# Altium project 转叶板.PrjPcb
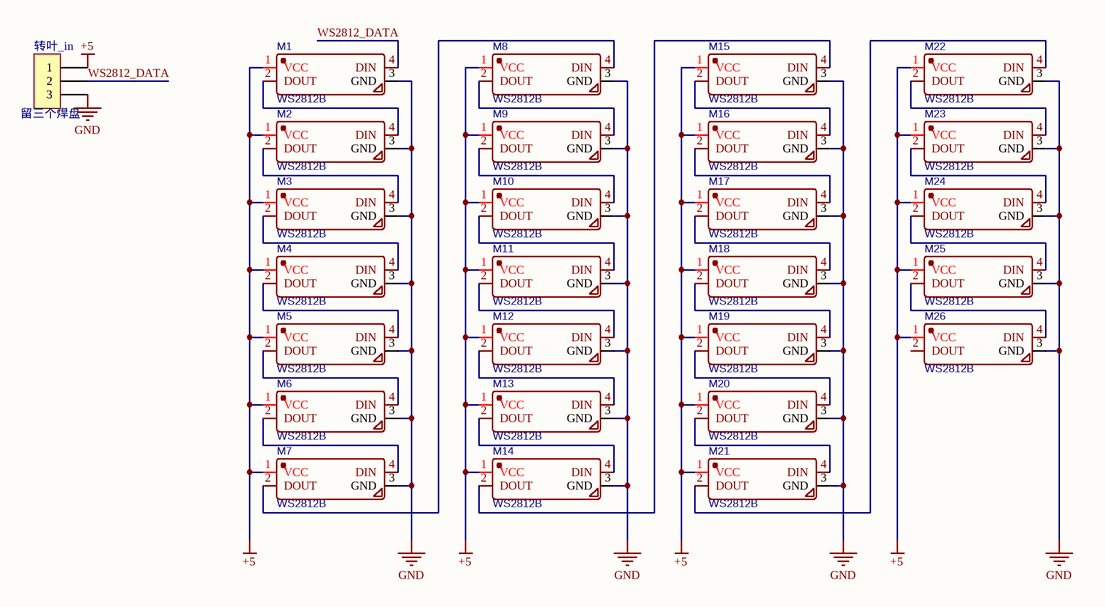
[diagram p0: 转叶板-转叶.SchDoc]
1 sheet, 27 parts. Net scope: global (net labels, ports and power ports of the same name join across sheets).
Board file: 转叶板-转叶.PcbDoc

## Sheet 转叶板-转叶.SchDoc
size A4; SheetNumber: 1; SheetTotal: 1

### Parts
M1  WS2812B  [WS2812-NEW]
M2  WS2812B  [WS2812-NEW]
M3  WS2812B  [WS2812-NEW]
M4  WS2812B  [WS2812-NEW]
M5  WS2812B  [WS2812-NEW]
M6  WS2812B  [WS2812-NEW]
M7  WS2812B  [WS2812-NEW]
M8  WS2812B  [WS2812-NEW]
M9  WS2812B  [WS2812-NEW]
M10  WS2812B  [WS2812-NEW]
M11  WS2812B  [WS2812-NEW]
M12  WS2812B  [WS2812-NEW]
M13  WS2812B  [WS2812-NEW]
M14  WS2812B  [WS2812-NEW]
M15  WS2812B  [WS2812-NEW]
M16  WS2812B  [WS2812-NEW]
M17  WS2812B  [WS2812-NEW]
M18  WS2812B  [WS2812-NEW]
M19  WS2812B  [WS2812-NEW]
M20  WS2812B  [WS2812-NEW]
M21  WS2812B  [WS2812-NEW]
M22  WS2812B  [WS2812-NEW]
M23  WS2812B  [WS2812-NEW]
M24  WS2812B  [WS2812-NEW]
M25  WS2812B  [WS2812-NEW]
M26  WS2812B  [WS2812-NEW]
转叶_in  留三个焊盘  [Pin HDR1X3/2.54mm-S]

### Nets
+5: M1.1(VCC) M2.1(VCC) M3.1(VCC) M4.1(VCC) M5.1(VCC) M6.1(VCC) M7.1(VCC) M8.1(VCC) M9.1(VCC) M10.1(VCC) M11.1(VCC) M12.1(VCC) M13.1(VCC) M14.1(VCC) M15.1(VCC) M16.1(VCC) M17.1(VCC) M18.1(VCC) M19.1(VCC) M20.1(VCC) M21.1(VCC) M22.1(VCC) M23.1(VCC) M24.1(VCC) M25.1(VCC) M26.1(VCC) 转叶_in.1
GND: M1.3(GND) M2.3(GND) M3.3(GND) M4.3(GND) M5.3(GND) M6.3(GND) M7.3(GND) M8.3(GND) M9.3(GND) M10.3(GND) M11.3(GND) M12.3(GND) M13.3(GND) M14.3(GND) M15.3(GND) M16.3(GND) M17.3(GND) M18.3(GND) M19.3(GND) M20.3(GND) M21.3(GND) M22.3(GND) M23.3(GND) M24.3(GND) M25.3(GND) M26.3(GND) 转叶_in.3
WS2812_DATA: M1.4(DIN) 转叶_in.2
NetM1_2: M1.2(DOUT) M2.4(DIN)
NetM2_2: M2.2(DOUT) M3.4(DIN)
NetM3_2: M3.2(DOUT) M4.4(DIN)
NetM4_2: M4.2(DOUT) M5.4(DIN)
NetM5_2: M5.2(DOUT) M6.4(DIN)
NetM6_2: M6.2(DOUT) M7.4(DIN)
NetM7_2: M7.2(DOUT) M8.4(DIN)
NetM8_2: M8.2(DOUT) M9.4(DIN)
NetM9_2: M9.2(DOUT) M10.4(DIN)
NetM10_2: M10.2(DOUT) M11.4(DIN)
NetM11_2: M11.2(DOUT) M12.4(DIN)
NetM12_2: M12.2(DOUT) M13.4(DIN)
NetM13_2: M13.2(DOUT) M14.4(DIN)
NetM14_2: M14.2(DOUT) M15.4(DIN)
NetM15_2: M15.2(DOUT) M16.4(DIN)
NetM16_2: M16.2(DOUT) M17.4(DIN)
NetM17_2: M17.2(DOUT) M18.4(DIN)
NetM18_2: M18.2(DOUT) M19.4(DIN)
NetM19_2: M19.2(DOUT) M20.4(DIN)
NetM20_2: M20.2(DOUT) M21.4(DIN)
NetM21_2: M21.2(DOUT) M22.4(DIN)
NetM22_2: M22.2(DOUT) M23.4(DIN)
NetM23_2: M23.2(DOUT) M24.4(DIN)
NetM24_2: M24.2(DOUT) M25.4(DIN)
NetM25_2: M25.2(DOUT) M26.4(DIN)

Not connected (* = marked no-connect by the designer): M26 2(DOUT)

### Library data of the parts
M1-M26 = WS2812B: BOM_Manufacturer: Worldsemi; Contributor: LCSC; SMT Type: Extend; BOM_Supplier: LCSC; BOM_Manufacturer Part: WS2812B; BOM_Supplier Part: C114585; BOM_LCSC Assembly: Yes; spicePre: L; spiceSymbolName: WS2812B
转叶_in = Pin HDR1X3: ComponentLink1Description: System; ComponentLink1URL: Connector